# Altium project WatchX_Pro.PrjPCB
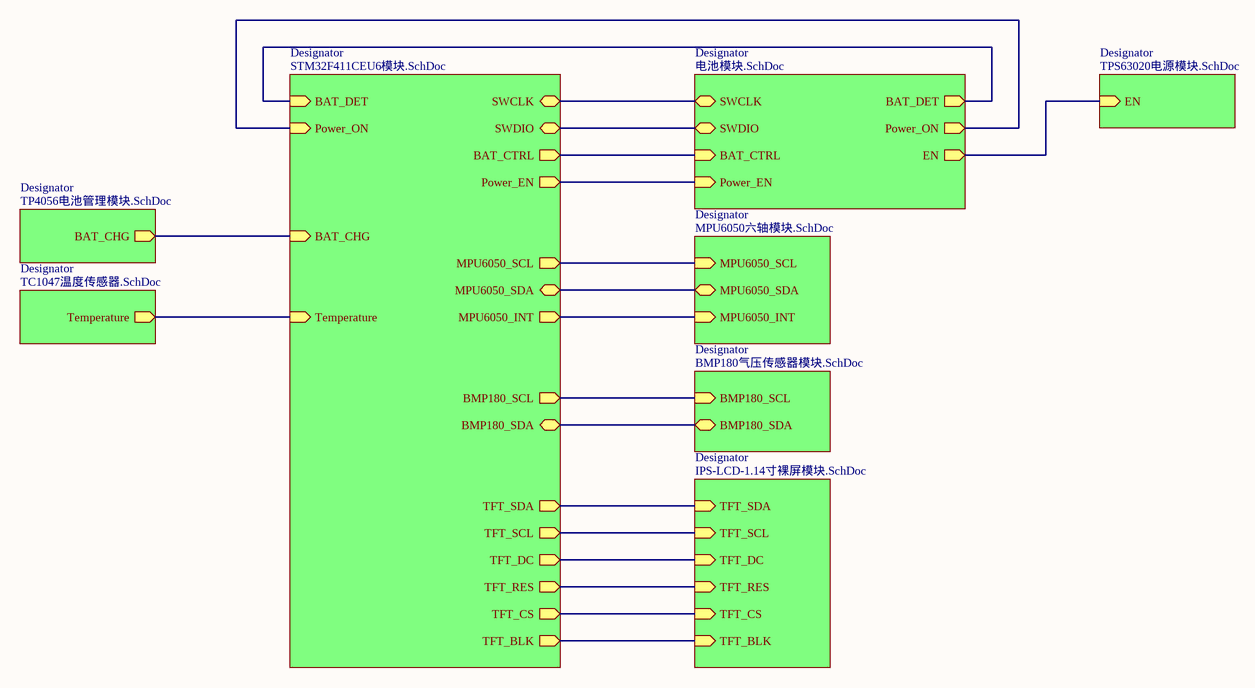
[diagram p0: WatchX_Pro.SchDoc]
3 sheets, 6 parts. Net scope: hierarchical (ports join the sheet entries above them; power ports are global).
Board file: WatchX_Pro.PcbDoc
Sheets:
  WatchX_Pro.SchDoc
    Designator = BMP180气压传感器模块.SchDoc
    Designator = TC1047温度传感器.SchDoc

## Sheet WatchX_Pro.SchDoc
size A4

### Sub-sheets
Designator = BMP180气压传感器模块.SchDoc: BMP180_SCL (in), BMP180_SDA (bidir)
Designator = IPS-LCD-1.14寸裸屏模块.SchDoc (file not in this document): TFT_SDA (in), TFT_SCL (in), TFT_DC (in), TFT_RES (in), TFT_CS (in), TFT_BLK (in)
Designator = MPU6050六轴模块.SchDoc (file not in this document): MPU6050_SCL (in), MPU6050_SDA (bidir), MPU6050_INT (in)
Designator = STM32F411CEU6模块.SchDoc (file not in this document): BMP180_SCL (out), BMP180_SDA (bidir), Temperature (in), Power_ON (in), Power_EN (out), MPU6050_SCL (out), MPU6050_SDA (bidir), MPU6050_INT (out), TFT_SDA (out), TFT_SCL (out), TFT_DC (out), TFT_RES (out), TFT_CS (out), TFT_BLK (out), BAT_DET (in), BAT_CHG (in), BAT_CTRL (out), SWCLK (bidir), SWDIO (bidir)
Designator = TP4056电池管理模块.SchDoc (file not in this document): BAT_CHG (out)
Designator = TPS63020电源模块.SchDoc (file not in this document): EN (in)
Designator = TC1047温度传感器.SchDoc: Temperature (out)
Designator = 电池模块.SchDoc (file not in this document): SWCLK (bidir), SWDIO (bidir), BAT_DET (out), BAT_CTRL (in), Power_ON (out), Power_EN (in), EN (out)

### Nets
BMP180_SCL: sheet Designator/BMP180_SCL, sheet Designator/BMP180_SCL
BMP180_SDA: sheet Designator/BMP180_SDA, sheet Designator/BMP180_SDA
Temperature: sheet Designator/Temperature, sheet Designator/Temperature
(unnamed): sheet Designator/TFT_SDA, sheet Designator/TFT_SDA
(unnamed): sheet Designator/TFT_SCL, sheet Designator/TFT_SCL
(unnamed): sheet Designator/TFT_DC, sheet Designator/TFT_DC
(unnamed): sheet Designator/TFT_RES, sheet Designator/TFT_RES
(unnamed): sheet Designator/TFT_CS, sheet Designator/TFT_CS
(unnamed): sheet Designator/TFT_BLK, sheet Designator/TFT_BLK
(unnamed): sheet Designator/MPU6050_SCL, sheet Designator/MPU6050_SCL
(unnamed): sheet Designator/MPU6050_SDA, sheet Designator/MPU6050_SDA
(unnamed): sheet Designator/MPU6050_INT, sheet Designator/MPU6050_INT
(unnamed): sheet Designator/Power_ON, sheet Designator/Power_ON
(unnamed): sheet Designator/Power_EN, sheet Designator/Power_EN
(unnamed): sheet Designator/BAT_DET, sheet Designator/BAT_DET
(unnamed): sheet Designator/BAT_CHG, sheet Designator/BAT_CHG
(unnamed): sheet Designator/BAT_CTRL, sheet Designator/BAT_CTRL
(unnamed): sheet Designator/SWCLK, sheet Designator/SWCLK
(unnamed): sheet Designator/SWDIO, sheet Designator/SWDIO
(unnamed): sheet Designator/EN, sheet Designator/EN

## Sheet BMP180气压传感器模块.SchDoc
size A4
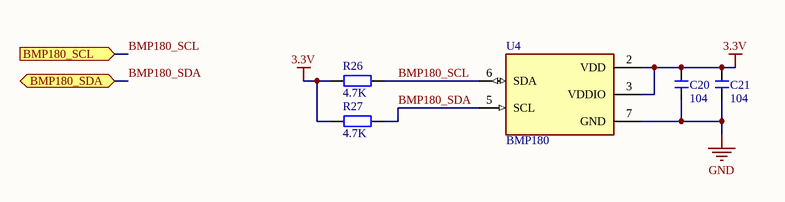
[diagram p1: BMP180气压传感器模块.SchDoc]

### Parts
C20  104  [C 0603_L]
C21  104  [C 0603_L]
R26  4.7K  [R 0603_L]
R27  4.7K  [R 0603_L]
U4  BMP180  [LGA-7]

### Ports
BMP180_SCL (in), BMP180_SDA (bidir)

### Nets
3.3V: C20.2 C21.2 R26.2 R27.2 U4.2(VDD) U4.3(VDDIO)
GND: C20.1 C21.1 U4.7(GND)
BMP180_SCL: R26.1 U4.6(SDA) ; port BMP180_SCL
BMP180_SDA: R27.1 U4.5(SCL) ; port BMP180_SDA

### Library data of the parts
C20 C21 = C: 无极性贴片电容; 版权归属: 黎明电子style; BOM名称: 无极性贴片电容; 学习资源: https://lmdzstyle.taobao.com/
R26 R27 = R: 贴片电阻; 版权归属: 黎明电子style; BOM名称: 贴片电阻; 学习资源: https://lmdzstyle.taobao.com/
U4 = BMP180: 气压传感器Pressure Sensor 4.35PSI ~ 15.95PSI _30kPa ~ 110kPa_ Absolute 16 ~ 19 b 7-VLGA; MF: Bosch Sensortec; Digi-Key_Purchase_URL: https://www.digikey.com/product-detail/en/bosch-sensortec/BMP180/828-1027-1-ND/2688260?utm_source=snapeda&utm_medium=aggregator&utm_campaign=symbol; Digi-Key_Part_Number: 828-1027-1-ND; Package: VLGA-7 Bosch Sensortec; SnapEDA_Link: https://www.snapeda.com/parts/BMP180/Bosch%20Sensortec/view-part/587596/?ref=snap; Value: *; MP: BMP180

## Sheet TC1047温度传感器.SchDoc: TC1047温度传感器
size A4; Engineer: 涵尘; SheetNumber: 8
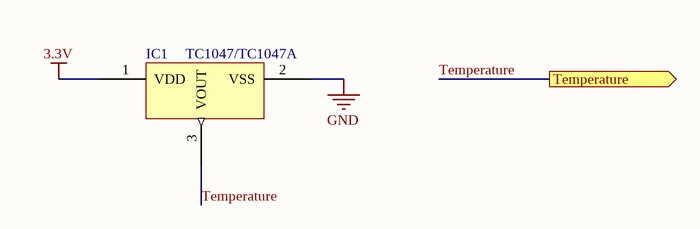
[diagram p2: TC1047温度传感器.SchDoc]

### Parts
IC1  TC1047/TC1047A  [SOT23-3L]

### Ports
Temperature (out)

### Nets
3.3V: IC1.1(VDD)
GND: IC1.2(VSS)
Temperature: IC1.3(VOUT) ; port Temperature

### Library data of the parts
IC1 = TC1047/TC1047A: 温度传感器 温度=(电压-500mV)÷10，测温范围-40℃~125℃

## Nets that join several sheets
3.3V: BMP180气压传感器模块 (6 pins), TC1047温度传感器 (IC1.1)
GND: BMP180气压传感器模块 (C20.1 C21.1 U4.7), TC1047温度传感器 (IC1.2)